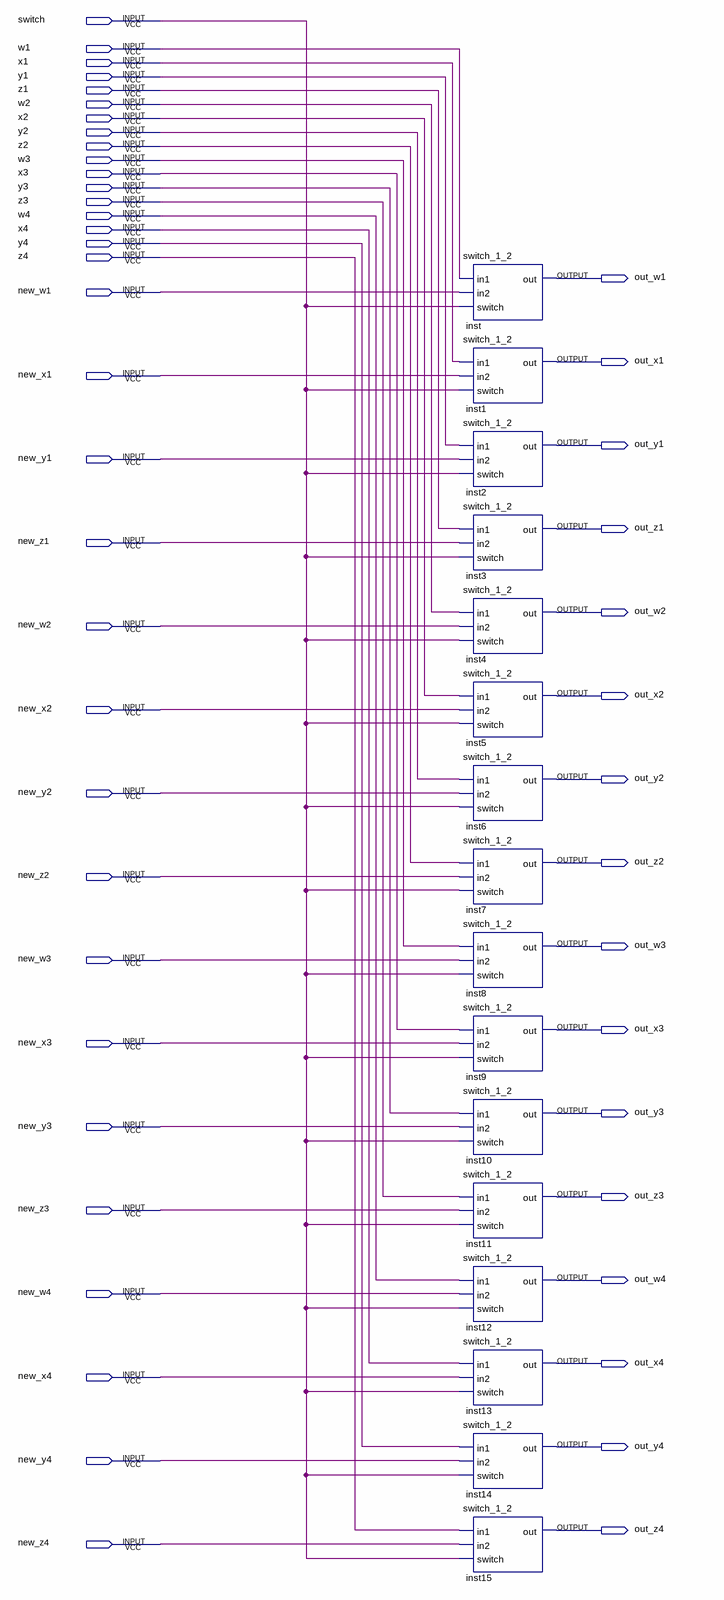
[diagram p0: schematic sheet]
// Quartus schematic switch_32_16.bdf as structural Verilog: 16 symbols, 49 pins
module switch_32_16 (
  input  switch,
  input  w1,
  input  x1,
  input  y1,
  input  z1,
  input  w2,
  input  x2,
  input  y2,
  input  z2,
  input  w3,
  input  x3,
  input  y3,
  input  z3,
  input  w4,
  input  x4,
  input  y4,
  input  z4,
  input  new_w1,
  input  new_x1,
  input  new_y1,
  input  new_z1,
  input  new_w2,
  input  new_x2,
  input  new_y2,
  input  new_z2,
  input  new_w3,
  input  new_x3,
  input  new_y3,
  input  new_z3,
  input  new_w4,
  input  new_x4,
  input  new_y4,
  input  new_z4,
  output out_w1,
  output out_x1,
  output out_y1,
  output out_z1,
  output out_w2,
  output out_x2,
  output out_y2,
  output out_z2,
  output out_w3,
  output out_x3,
  output out_y3,
  output out_z3,
  output out_w4,
  output out_x4,
  output out_y4,
  output out_z4
);

  switch_1_2 inst (.in1(w1), .in2(new_w1), .switch(switch), .out(out_w1));
  switch_1_2 inst1 (.in1(x1), .in2(new_x1), .switch(switch), .out(out_x1));
  switch_1_2 inst2 (.in1(y1), .in2(new_y1), .switch(switch), .out(out_y1));
  switch_1_2 inst3 (.in1(z1), .in2(new_z1), .switch(switch), .out(out_z1));
  switch_1_2 inst4 (.in1(w2), .in2(new_w2), .switch(switch), .out(out_w2));
  switch_1_2 inst5 (.in1(x2), .in2(new_x2), .switch(switch), .out(out_x2));
  switch_1_2 inst6 (.in1(y2), .in2(new_y2), .switch(switch), .out(out_y2));
  switch_1_2 inst7 (.in1(z2), .in2(new_z2), .switch(switch), .out(out_z2));
  switch_1_2 inst8 (.in1(w3), .in2(new_w3), .switch(switch), .out(out_w3));
  switch_1_2 inst9 (.in1(x3), .in2(new_x3), .switch(switch), .out(out_x3));
  switch_1_2 inst10 (.in1(y3), .in2(new_y3), .switch(switch), .out(out_y3));
  switch_1_2 inst11 (.in1(z3), .in2(new_z3), .switch(switch), .out(out_z3));
  switch_1_2 inst12 (.in1(w4), .in2(new_w4), .switch(switch), .out(out_w4));
  switch_1_2 inst13 (.in1(x4), .in2(new_x4), .switch(switch), .out(out_x4));
  switch_1_2 inst14 (.in1(y4), .in2(new_y4), .switch(switch), .out(out_y4));
  switch_1_2 inst15 (.in1(z4), .in2(new_z4), .switch(switch), .out(out_z4));
endmodule
